# Altium schematic sheet Color_V1.0.SchDoc
size A4
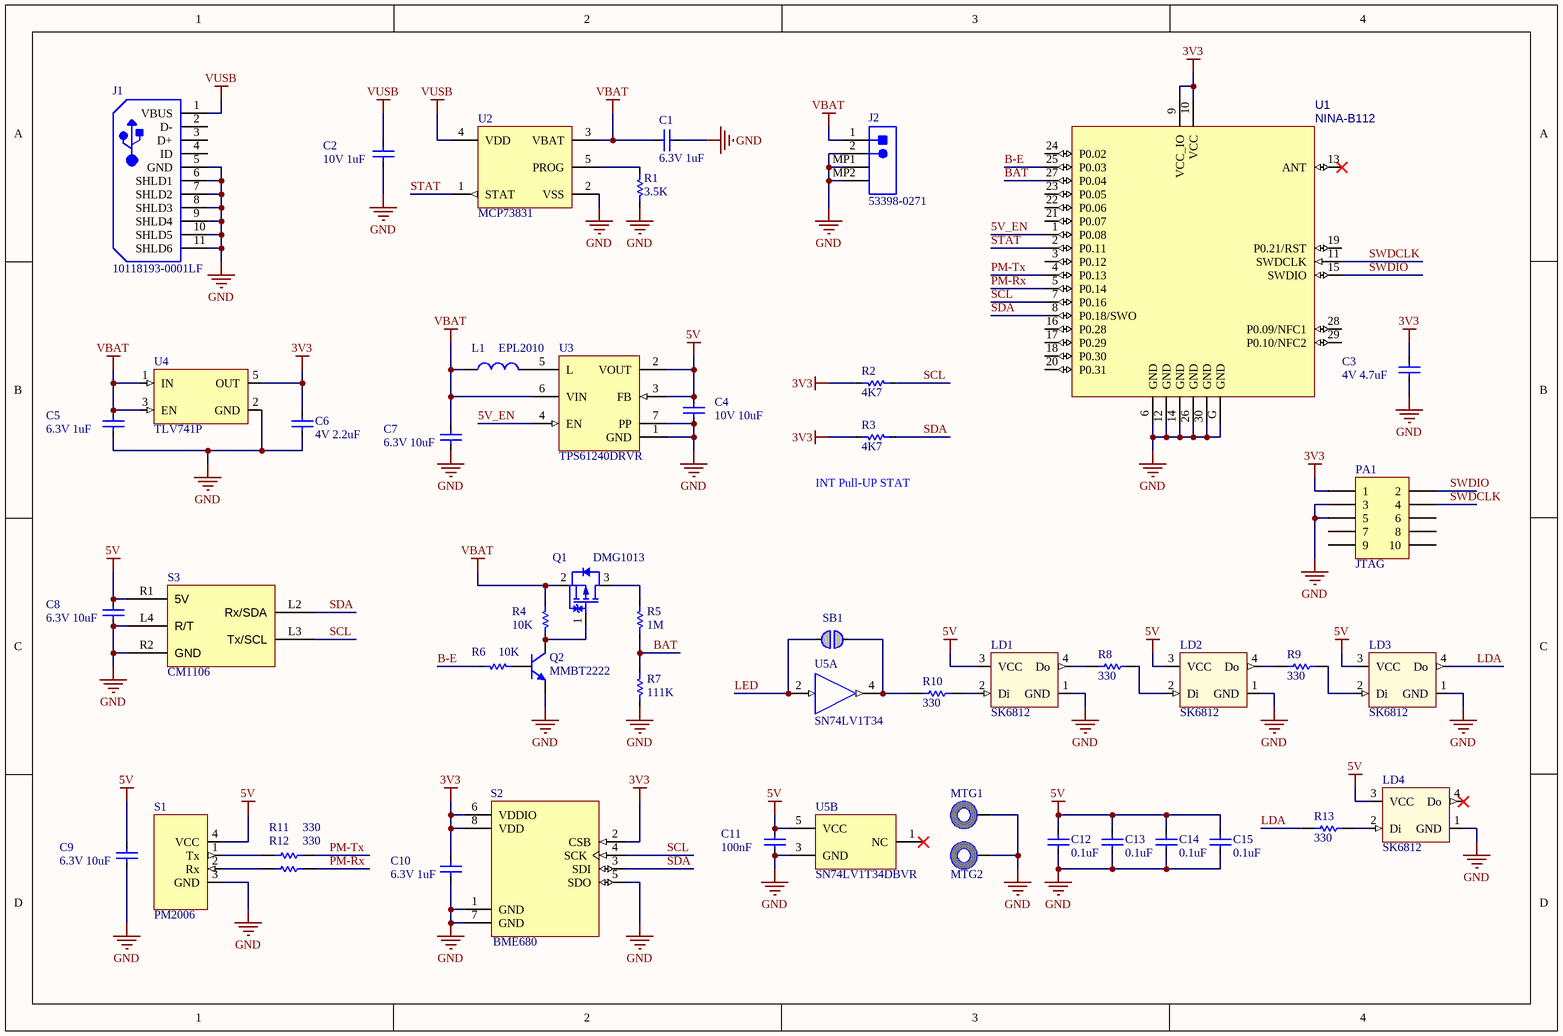
[diagram p0: Color_V1.0.SchDoc]

## Parts
C1  value 6.3V 1uF  [CAPC1608X90N_2]  (hidden comment: Cap)
C2  value 10V 1uF  [CAPC1608X90N_2]  (hidden comment: Cap)
C3  value 4V 4.7uF  [CAPC1608X90N_2]  (hidden comment: Cap)
C4  value 10V 10uF  [CAPC1608X90N_2]  (hidden comment: Cap)
C5  value 6.3V 1uF  [CAPC1608X90N_2]  (hidden comment: Cap)
C6  value 4V 2.2uF  [CAPC1608X90N_2]  (hidden comment: Cap)
C7  value 6.3V 10uF  [CAPC1608X90N_2]  (hidden comment: Cap)
C8  value 6.3V 10uF  [CAPC2012X145N]  (hidden comment: Cap)
C9  value 6.3V 10uF  [CAPC2012X145N]  (hidden comment: Cap)
C10  value 6.3V 1uF  [CAPC1608X90N_2]  (hidden comment: Cap)
C11  value 100nF  [CAPC1608X90N_2]  (hidden comment: Cap)
C12  value 0.1uF  [CAPC1608X90N_2]  (hidden comment: Cap)
C13  value 0.1uF  [CAPC1608X90N_2]  (hidden comment: Cap)
C14  value 0.1uF  [CAPC1608X90N_2]  (hidden comment: Cap)
C15  value 0.1uF  [CAPC1608X90N_2]  (hidden comment: Cap)
J1  10118193-0001LF  [FCI-10118193-0001LF-5_V]
J2  53398-0271  [MOLX-53398-0271_V]
L1  value EPL2010  [EPL2010]  (hidden comment: EPL2010-152)
LD1  SK6812  [WS2812B]
LD2  SK6812  [WS2812B]
LD3  SK6812  [WS2812B]
LD4  SK6812  [WS2812B]
MTG1  M2.5  [9774030151]  (value not drawn)
MTG2  M2.5  [9774030151]  (value not drawn)
PA1  JTAG  [MHDR2X5]
Q1  DMG1013  [DIOD-SOT323-3_V]
Q2  MMBT2222  [ONSC-SC-70-3-419-04_V]
R1  value 3.5K  [RESC1608X55N_2]  (hidden comment: Res1)
R2  value 4K7  [RESC1608X55N_2]  (hidden comment: Res1)
R3  value 4K7  [RESC1608X55N_2]  (hidden comment: Res1)
R4  value 10K  [RESC1608X55N_2]  (hidden comment: Res1)
R5  value 1M  [RESC1608X55N_2]  (hidden comment: Res1)
R6  value 10K  [RESC1608X55N_2]  (hidden comment: Res1)
R7  value 111K  [RESC1608X55N_2]  (hidden comment: Res1)
R8  value 330  [RESC1608X55N_2]  (hidden comment: Res1)
R9  value 330  [RESC1608X55N_2]  (hidden comment: Res1)
R10  value 330  [RESC1608X55N_2]  (hidden comment: Res1)
R11  value 330  [RESC1608X55N_2]  (hidden comment: Res1)
R12  value 330  [RESC1608X55N_2]  (hidden comment: Res1)
R13  value 330  [RESC1608X55N_2]  (hidden comment: Res1)
S1  PM2006  [PM2006]
S2  BME680  [BME680]
S3  CM1106  [CM1106]
SB1  Solderbridge  [Solderbridge]  (value not drawn)  (no BOM)
U1  NINA-B112  [NINA-B1]
U2  MCP73831  [SOT-23-OT5_M]
U3  TPS61240DRVR  [DRV6-1600X1000TP]
U4  TLV741P  [SOT23-5]
U5  SN74LV1T34  [DBV0005A_M]  (parts A,B of 2)

## Nets
3V3: C3.2 C6.1 C10.1 PA1.1 R2.2 R3.2 S2.2(CSB) S2.6(VDDIO) S2.8(VDD) U1.9(VCC_IO) U1.10(VCC) U4.5(OUT)
5V: C4.2 C8.2 C9.2 C11.1 C12.2 C13.2 C14.2 C15.2 LD1.3(VCC) LD2.3(VCC) LD3.3(VCC) LD4.3(VCC) S1.4(VCC) S3.R1(5V) U3.2(VOUT) U3.3(FB) U5.5(VCC)
GND: C1.1 C2.2 C3.1 C4.1 C5.1 C6.2 C7.1 C8.1 C9.1 C10.2 C11.2 C12.1 C13.1 C14.1 C15.1 J1.5(GND) J1.6(SHLD1) J1.7(SHLD2) J1.8(SHLD3) J1.9(SHLD4) J1.10(SHLD5) J1.11(SHLD6) J2.2 J2.MP1 J2.MP2 LD1.1(GND) LD2.1(GND) LD3.1(GND) LD4.1(GND) MTG1.1 MTG2.1 PA1.3 PA1.5 Q2.2(E) R1.1 R7.1 S1.3(GND) S2.1(GND) S2.5(SDO) S2.7(GND) S3.L4(R/T) S3.R2(GND) U1.6(GND) U1.12(GND) U1.14(GND) U1.26(GND) U1.30(GND) U1.G(GND) U2.2(VSS) U3.1(GND) U3.7(PP) U4.2(GND) U5.3(GND)
VBAT: C1.2 C5.2 C7.2 J2.1 L1.1 Q1.2(S) R4.2 U2.3(VBAT) U3.6(VIN) U4.1(IN) U4.3(EN)
VUSB: C2.1 J1.1(VBUS) U2.4(VDD)
5V_EN: U1.1(P0.08) U3.4(EN)
B-E: R6.1 U1.25(P0.03)
BAT: R5.1 R7.2 U1.27(P0.04)
LDA: LD3.4(Do) R13.2
LED: SB1.2 U5.2(A)
PM-Rx: R12.1 U1.5(P0.14)
PM-Tx: R11.1 U1.4(P0.13)
SCL: R2.1 S2.4(SCK) S3.L3(Tx/SCL) U1.7(P0.16)
SDA: R3.1 S2.3(SDI) S3.L2(Rx/SDA) U1.8(P0.18/SWO)
STAT: U1.2(P0.11) U2.1(STAT)
SWDCLK: PA1.4 U1.11(SWDCLK)
SWDIO: PA1.2 U1.15(SWDIO)
NetL1_2: L1.2 U3.5(L)
NetLD1_2: LD1.2(Di) R10.1
NetLD1_4: LD1.4(Do) R8.2
NetLD2_2: LD2.2(Di) R8.1
NetLD2_4: LD2.4(Do) R9.2
NetLD3_2: LD3.2(Di) R9.1
NetLD4_2: LD4.2(Di) R13.1
NetQ1_1: Q1.1(G) Q2.3(C) R4.1
NetQ1_3: Q1.3(D) R5.2
NetQ2_1: Q2.1(B) R6.2
NetR1_2: R1.2 U2.5(PROG)
NetR10_2: R10.2 SB1.1 U5.4(Y)
NetR11_2: R11.2 S1.1(Tx)
NetR12_2: R12.2 S1.2(Rx)

Not connected (* = marked no-connect by the designer): J1 2(D-) 3(D+) 4(ID); LD4 4(Do)*; PA1 6 7 8 9 10; S3 D1(L1) L5(CA) R3(A) R4(PWM); U1 3(P0.12) 13(ANT)* 16(P0.28) 17(P0.29) 18(P0.30) 19(P0.21/RST) 20(P0.31) 21(P0.07) 22(P0.06) 23(P0.05) 24(P0.02) 28(P0.09/NFC1) 29(P0.10/NFC2); U5 1(NC)*

## Notes on the sheet
- (near R3) INT Pull-UP STAT

## Library data of the parts
C1-C15 = Cap: Capacitor; Published: 8-Jun-2000; LatestRevisionDate: 17-Jul-2002; LatestRevisionNote: Re-released for DXP Platform.; PackageReference: RAD-0.3; Publisher: Altium Limited; PackageDescription: Radial Cap, Thru-Hole; 2 Leads; 0.3 in Pin Spacing
J1 = CMP-2000-05119-1: Micro USB B Type Receptacle, -55 to 85 degC, 5-Pin SMD, RoHS, Tape and Reel; Manufacturer: FCI; Insulation Resistance: 1000MOhms; Gender: Female; Current Rating: 1.8A; Number of Contacts: 5Contact; Connector Type: MicroUSBTypeBreceptacle; Mounting Angle: Right; Datasheet Version: Rev. C, 05/2015; Packaging: Reel; Product Category: USBConnectors; Standard: USB2.0; Factory Pack Quantity: 1200; Operating Temperature Range: -55Cto+85C; Termination Style: SMD/SMT; Datasheet URL: http://datasheet.octopart.com/10118193-0001LF-FCI-datasheet-55953155.pdf; Contact Material: CopperAlloy; RoHS: Details; Contact Plating: Gold; Flammability Rating: UL94V-0; Manufacturer URL: http://www.fci.com/; Brand: FCI; Product: MicroUSBTypeBConnectors; Color: Black
J2 = CMP-2000-07600-1: Male Header, Pitch 1.25 mm, 1 x 2 Position, Height 4.7 mm, -40 to 85 degC, RoHS, Tape and Reel; Manufacturer: Molex; Voltage Rating: 125V; Glow Wire Compliant: Non-compliant; Pitch: 1.25mm; Number of Positions: 2; Contact Resistance: 20mOhm; Insulation Resistance: 100MOhm; Current Rating: 1A; Mounting Technology: SurfaceMount; Colour: Natural; Mount: SurfaceMount; Termination: Solder; Packaging: TapeandReel; REACH SVHC: Unknown; Voltage Rating (AC): 125V; Housing Colour: Natural; Manufacturer URL: http://www.molex.com/; Max Operating Temperature: 85degC; Gender: Male; Lead Free: LeadFree; RoHSCompliant: True; Contact Plating: Tin; Package Reference: 53398-0271; Contact Material: Tin; Orientation: Vertical; Datasheet URL: http://www.molex.com/pdm_docs/sd/533980271_sd.pdf; Working Voltage: 125V; Flammability Rating: UL94V-0; Number of Contacts: 2; Package Description: Male Header, Pitch 1.25 mm, 1 x 2 Position, Height 4.7 mm; Datasheet Version: Rev. J, 09/2015; Number of Circuits: 2; Number of Rows: 1; Radiation Hardening: No; Voltage Rating (DC): 125V; Min Operating Temperature: -40degC; Housing Material: Nylon; Package Quantity: 1000
L1 = Inductor: Code_IEC: 1005; Published: 8-Jun-2000; LatestRevisionDate: 29-May-2009; LatestRevisionNote: IPC-7351 Footprint Added.; PackageReference: 0402-A; Publisher: Altium Limited; PackageDescription: Chip Inductor; Code_JEITA: 0402
MTG1 MTG2 = 9774030151R: WA-SMSI SMT Steel Spacer, M2.5 Thread Internal, Length 3mm; InnerDiameter: 3.5mm; OuterDiameter: 5.1mm; PublishedDate: Dec. 2016; Publisher: Wurth Elektronik; ComponentLink1Description: Manufacturer; ComponentLink1URL: http://www.we-online.de; ComponentLink2Description: Datasheet; ComponentLink2URL: http://katalog.we-online.de/em/datasheet/9774030151R.pdf; PartNumber: 9774030151R; Length: 3mm; Thread: M2.5; Packaging: Tape and Reel
PA1 = MHDR2X5: Header, 5-Pin, Dual row; LatestRevisionDate: 17-Jul-2002; LatestRevisionNote: Re-released for DXP Platform.; Publisher: Altium Limited
Q1 = CMP-2000-06170-1: P-Channel Enhancement Mode MOSFET, 310 mW, 20 V, -55 to 150 degC, 3-Pin SOT-323, RoHS, Tape and Reel; Manufacturer: Diodes Inc; Qg Gate Charge: 0.622nC; Drain-Source On Resistance-Max: 750mO; Rated Power Dissipation: 310mW; Drain-to-Source Voltage [Vdss]: 20V; Package Reference: SOT323; Datasheet Version: Rev. 3-2, 09/2013; Package Description: 3-Pin Small Outline Transistor, Body 2 x 1.25 mm, Pitch 0.65 mm; Mounting Technology: SurfaceMount; Manufacturer URL: http://www.diodes.com/; Datasheet URL: http://www.diodes.com/_files/datasheets/ds31861.pdf; Channel Type: P-Channel
Q2 = CMP-1048-00382-1: General Purpose Transistor, NPN Silicon, 3-Pin SC70, Pb-Free, Tape and Reel; PartNumber: MMBT2222AWT1G; Manufacturer: On Semiconductor; IC Continuous (A): 0.6; fT Min (MHz): 300; ComponentLink3URL: http://www.onsemi.cn/pub_link/Collateral/419-04.PDF; ComponentLink2URL: http://www.onsemi.cn/pub_link/Collateral/MMBT2222AWT1-D.PDF; DatasheetVersion: Rev. 6; ComponentLink1Description: Manufacturer URL; PackageReference: SC-70-3-419-04; Packing: Tape and Reel; Polarity: NPN; ComponentLink1URL: http://www.onsemi.com/; RoHS: TRUE; PackageVersion: Rev. N, 11/2008; Mounting Technology: Surface Mount; ComponentLink2Description: Datasheet; PackageDescription: 3-Pin Small Outline Transistor, Body 2 x 1.25 mm, Pitch 0.65 mm; ComponentLink3Description: Package Specification
R1-R13 = Res1: Resistor; Published: 8-Jun-2000; LatestRevisionDate: 17-Jul-2002; LatestRevisionNote: Re-released for DXP Platform.; PackageReference: AXIAL-0.3; Publisher: Altium Limited; PackageDescription: Axial Device, Thru-Hole; 2 Leads; 0.3 in Pin Spacing
S2 = BME680: Integrated Environmental Unit; MF: Bosch; Price: 9.29 USD; MP: BME680; SnapEDA_Link: https://www.snapeda.com/symbols-footprints/BME680/Bosch%20Sensortec/view-part/?ref=snap; Availability: Good; Package: LGA-8 Bosch Tools; Value: *
S3 = CM1106: MINI INFRARED CO2 MODULE CM1106 SERIES SINGLE BEAM
SB1 = SOLDERBRIDGE: Artikkelnr Noca: N.A.; Part Number: Solderbridge; Manufacturer: *; Manufacturer Part Number: *; Datasheet: *; LatestRevisionDate: 2009-12-14; Pin Count: 2; Publisher: Nordic Semiconductor; Published: 2009-12-14; Value: Solderbridge; Note: *; Supplier: *; Supplier part number: *; 2nd source Supplier: *; 2nd source part number: *; Footprint Doc: Solderbridge; Artikkelnr Simpro: N.A.
U1 = NINA-B1: Stand-alone Bluetooth low energy module; Manufacturer: u-blox; Part Description: Stand-alone Bluetooth low energy module; Value: NINA-B1
U2 = CMP-0133-00143-1: Miniature Single-Cell, Fully Integrated Li-Ion, Li-Polymer Charge Management Controller, 4.2V, 5-Pin SOT-23, Industrial Temperature, Tape and Reel; PackageReference: SOT-23-OT5; PackageDescription: 5-Lead Plastic Small Outline Transistor (OT) [SOT-23]; PackageVersion: revBB, Aug-2009; DatasheetVersion: revE, Sep-2008; Code_IPC: SOT23-5
U3 = CMP-0347-00037-1: Boost Voltage Converter with 2.3 to 5.5 V Input and 5 V Output, 6-Pin SON (DRV), Green (RoHS & no Sb/Br); Manufacturer: Texas Instruments; Synchronous Rectification: TRUE; Preset Vout(V): 5; SubFamily: Step-Up Regulator; Regulated Outputs(#): 1; Switching Frequency(Max)(kHz): 4000; Vin(Max)(V): 5.5; Vin(Min)(V): 2.3; Topology: Boost; Vout(Min)(V): 5; DatasheetVersion: SLVS806B; ComponentLink1Description: Datasheet; PackageReference: DRV6-1600X1000TP; Eco-Plan: Green (RoHS & no Sb/Br); PackageDescription: 6-Pin Plastic Small Outline No-Lead, 2 x 2 x 0.8 mm Body, 0.65 mm Pitch, Exposed Pad; PackageVersion: revE, Oct-2010; Vout(Max)(V): 5; PartNumber: TPS61240DRVR; ComponentLink2URL: http://www.ti.com/litv/pdf/mpds216d; ComponentLink1URL: http://www.ti.com/general/docs/lit/getliterature.tsp?genericPartNumber=TPS61240&fileType=pdf; ComponentLink2Description: Package Specification; Mounting Technology: Surface Mount
U4 = TLV741: Low-Dropout Regulator With Foldback Current Limit for Portable / Devices
U5 = CMP-0859-00123-3: Single Power Supply BUFFER Logic Level Shifter (no enable), DBV0005A, LARGE T&R; Manufacturer: Texas Instruments; F @ Nom Voltage(Max)(Mhz): 50; Logic: True; ICC @ Nom Voltage(Max)(mA): 0.01; Output Drive (IOL/IOH)(Max)(mA): 8/-8; Special Features: 1.8V to 3.3V Up Translation,3.3V to 1.8V Down Translation,5V Input Tolerant; VCC(Max)(V): 5.5; Technology Family: LV1T; tpd @ Nom Voltage(Max)(ns): 14.5,9.5,8.0,6.5; Rating: Catalog; Sub-Family: Non-Inverting Buffer/Driver; Input Type: TTL; VCC(Min)(V): 1.6; 3-State Output: Yes; Bits(#): 1; Voltage(Nom)(V): 1.8,2.5,3.3,5.5; Output Type: CMOS; PackageReference: DBV0005A; DatasheetVersion: SCLS743A; Schmitt Trigger: No; Operating Temperature Range(C): -40 to 125; Generic Part Number: SN74LV1T34